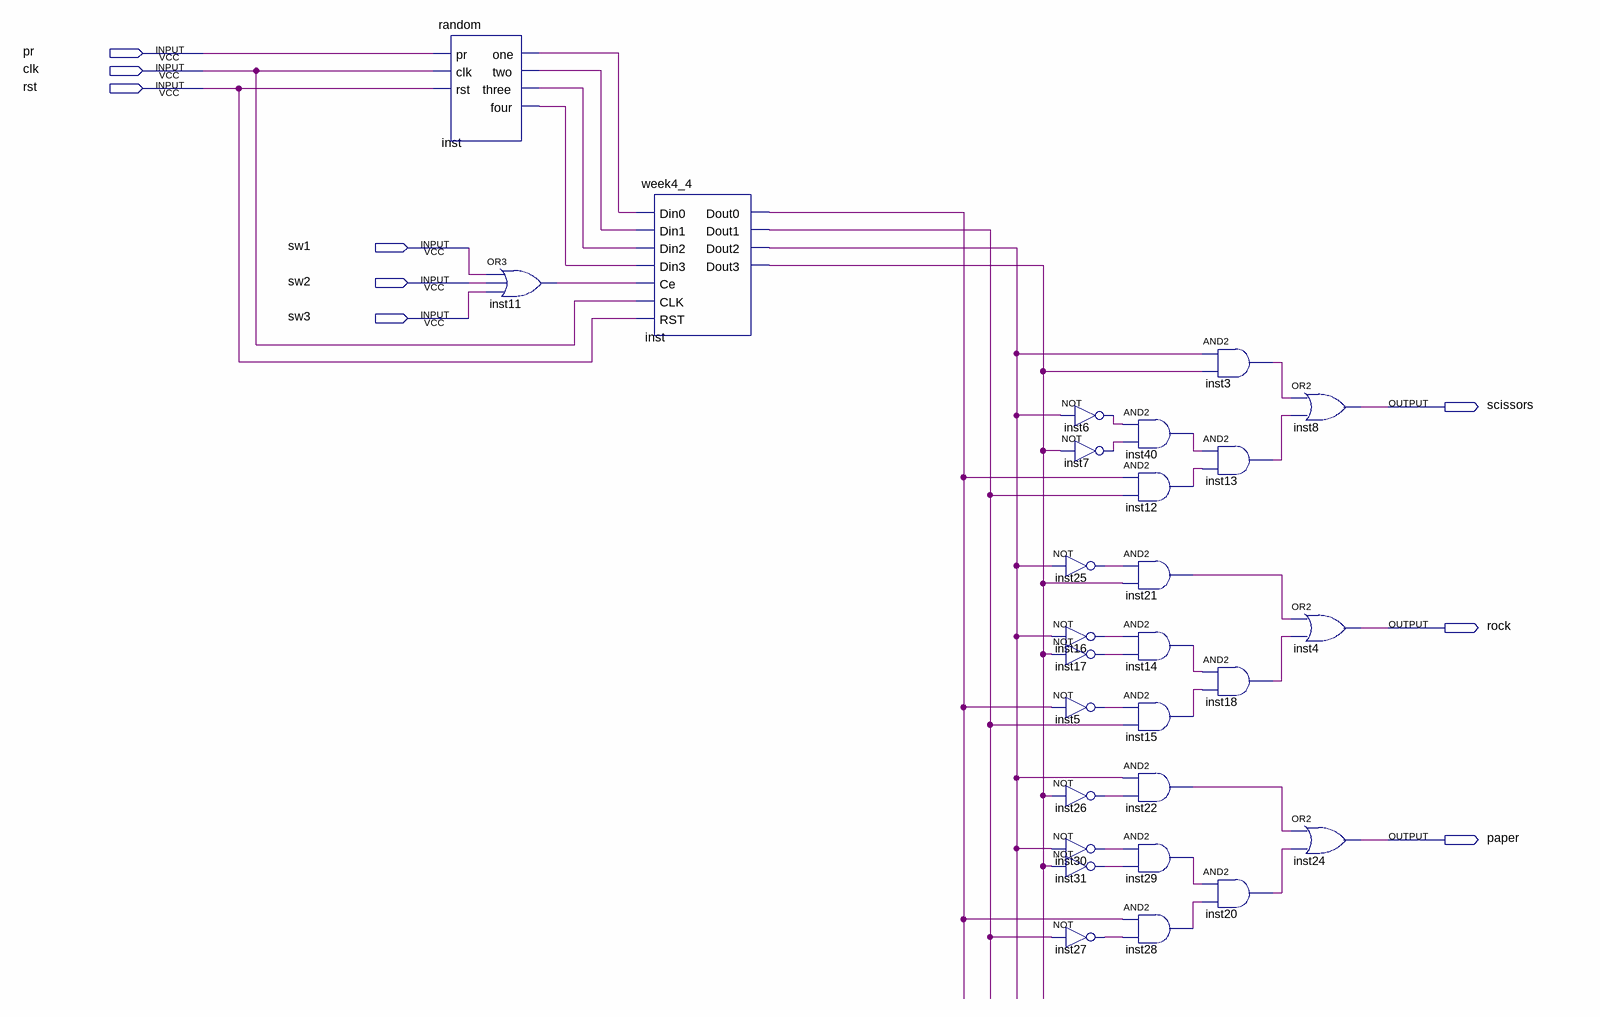
[diagram p0: schematic sheet]
// Quartus schematic rnd1_v2.bdf as structural Verilog: 28 symbols, 9 pins
module rnd1_v2 (
  input  pr,
  input  clk,
  input  rst,
  input  sw1,
  input  sw2,
  input  sw3,
  output scissors,
  output rock,
  output paper
);

  wire inst3_out, inst5_out, inst6_out, inst7_out, inst11_out, inst12_out, inst13_out, inst14_out,
       inst15_out, inst16_out, inst17_out, inst18_out, inst20_out, inst21_out, inst22_out, inst25_out,
       inst26_out, inst27_out, inst28_out, inst29_out, inst30_out, inst31_out, inst40_out, inst_dout0,
       inst_dout1, inst_dout2, inst_dout3, inst_four, inst_one, inst_three, inst_two;

  random inst (.pr(pr), .clk(clk), .rst(rst), .one(inst_one), .two(inst_two), .three(inst_three), .four(inst_four));
  or inst11 (inst11_out, sw1, sw2, sw3);
  week4_4 inst_dup2 (
    .Din0(inst_one), .Din1(inst_two), .Din2(inst_three), .Din3(inst_four), .Ce(inst11_out), .CLK(clk),
    .RST(rst), .Dout0(inst_dout0), .Dout1(inst_dout1), .Dout2(inst_dout2), .Dout3(inst_dout3));
  not inst6 (inst6_out, inst_dout2);
  not inst7 (inst7_out, inst_dout3);
  not inst25 (inst25_out, inst_dout2);
  not inst16 (inst16_out, inst_dout2);
  not inst17 (inst17_out, inst_dout3);
  not inst5 (inst5_out, inst_dout0);
  not inst26 (inst26_out, inst_dout3);
  not inst30 (inst30_out, inst_dout2);
  not inst31 (inst31_out, inst_dout3);
  not inst27 (inst27_out, inst_dout1);
  and inst40 (inst40_out, inst6_out, inst7_out);
  and inst12 (inst12_out, inst_dout0, inst_dout1);
  and inst21 (inst21_out, inst25_out, inst_dout3);
  and inst14 (inst14_out, inst16_out, inst17_out);
  and inst15 (inst15_out, inst5_out, inst_dout1);
  and inst22 (inst22_out, inst_dout2, inst26_out);
  and inst29 (inst29_out, inst30_out, inst31_out);
  and inst28 (inst28_out, inst_dout0, inst27_out);
  and inst3 (inst3_out, inst_dout2, inst_dout3);
  and inst13 (inst13_out, inst40_out, inst12_out);
  and inst18 (inst18_out, inst14_out, inst15_out);
  and inst20 (inst20_out, inst29_out, inst28_out);
  or inst8 (scissors, inst3_out, inst13_out);
  or inst4 (rock, inst21_out, inst18_out);
  or inst24 (paper, inst22_out, inst20_out);
endmodule
